# EAGLE design usbprog_v3 (EAGLE 4.16)
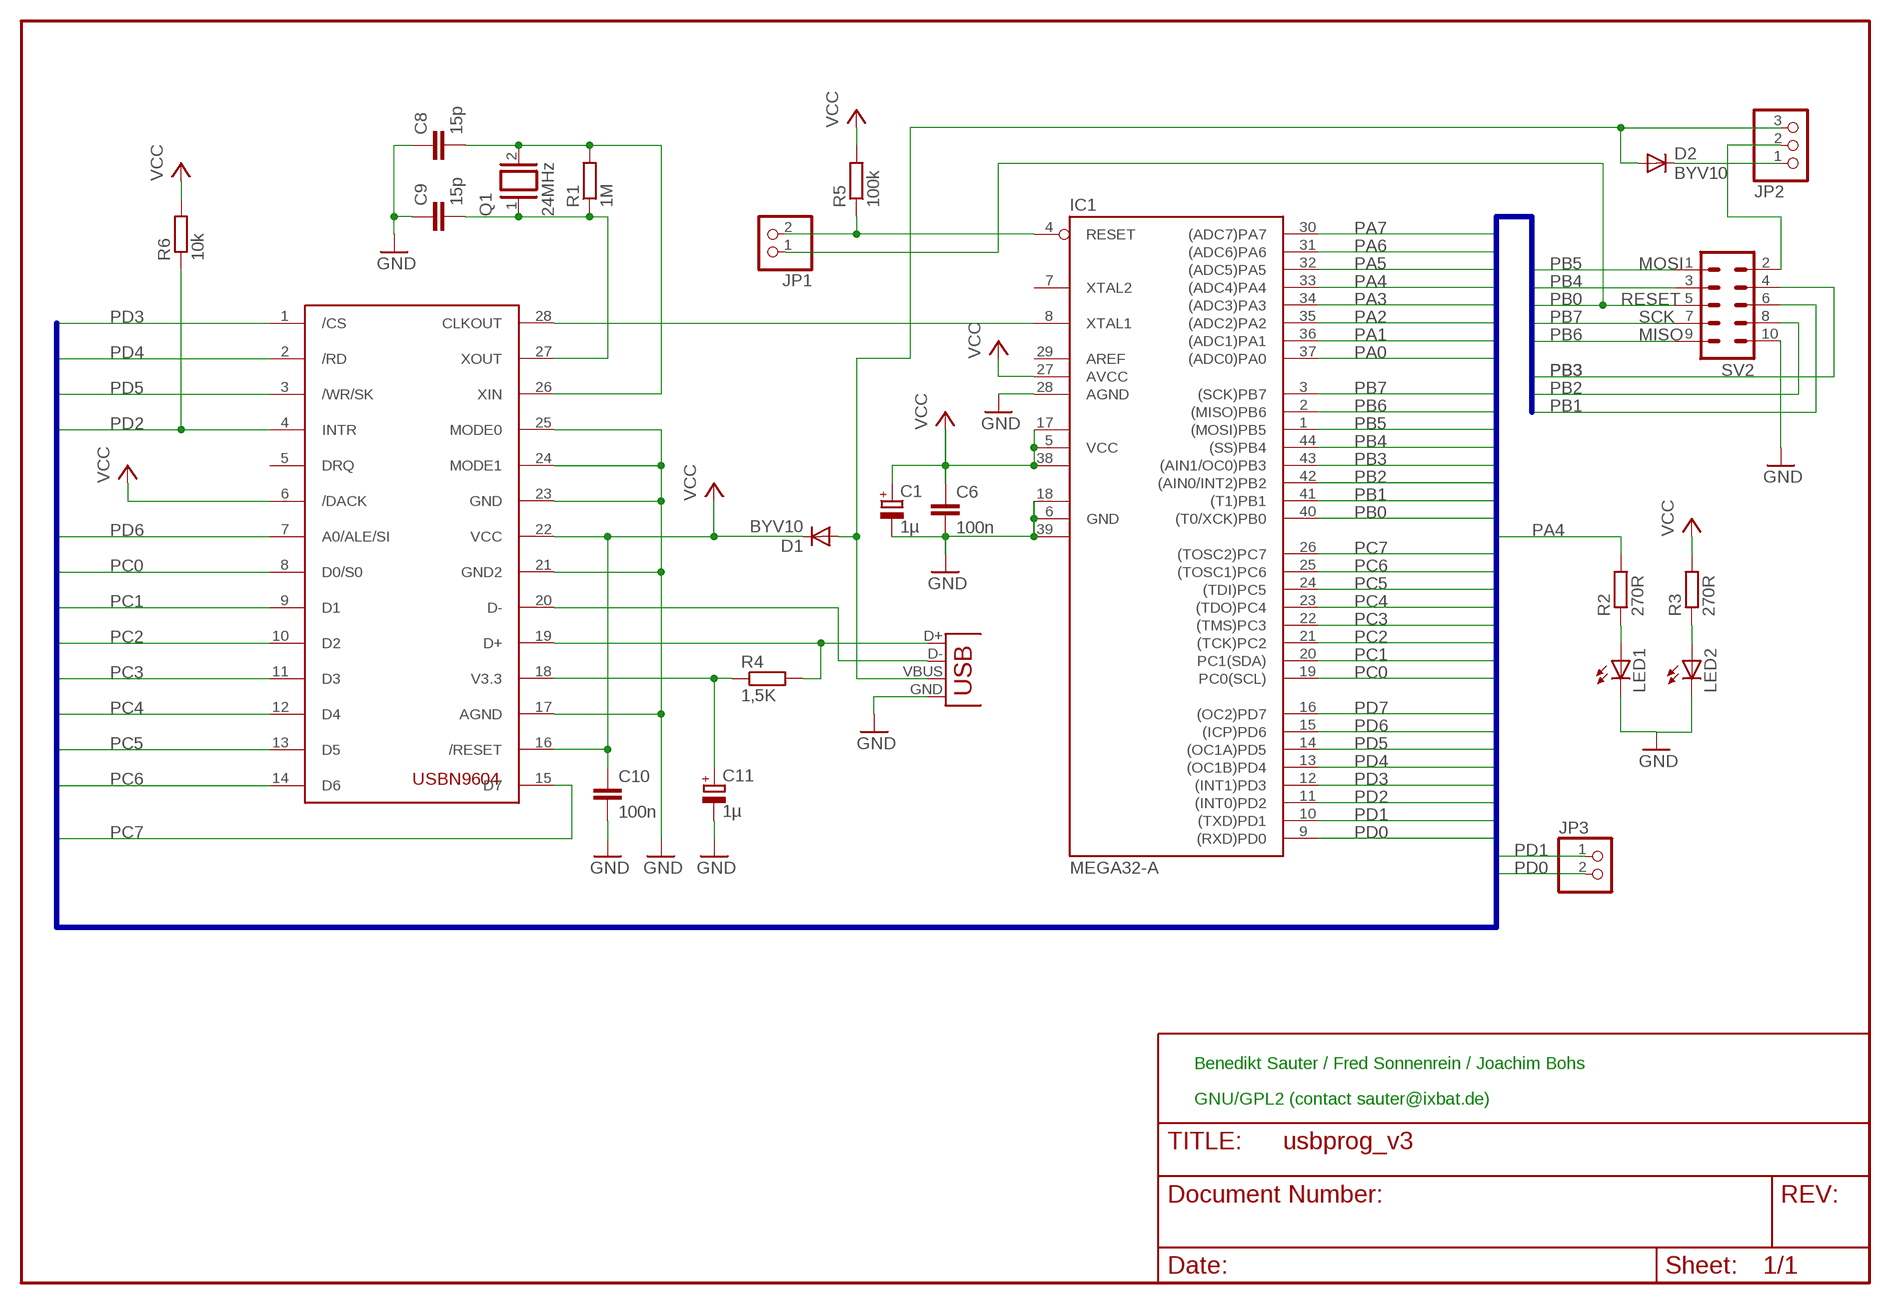
[diagram p0: schematic, sheet 1]

## Parts
C1  1µ  CPOL-EUCT3528  [CT3528]
C6  100n  C-EUC1206  [C1206]
C8  15p  C-EUC1206  [C1206]
C9  15p  C-EUC1206  [C1206]
C10  100n  C-EUC1206  [C1206]
C11  1µ  CPOL-EUCT3528  [CT3528]
D1  BYV10  DIODE-MELF-MLL41  [MELF-MLL41]
D2  BYV10  DIODE-MELF-MLL41  [MELF-MLL41]
IC1  MEGA32-A  [TQFP44]
IC2  USBN9604  [SO28-3]
JP1  PINHD-1X2  [1X02]
JP2  PINHD-1X3  [1X03]
JP3  PINHD-1X2  [1X02]
LED1  LEDCHIP-LED0805  [CHIP-LED0805]
LED2  LEDCHIP-LED0805  [CHIP-LED0805]
Q1  24MHz  XTAL/S  [QS]
R1  1M  R-EU_R1206  [R1206]
R2  270R  R-EU_M1206  [M1206]
R3  270R  R-EU_M1206  [M1206]
R4  1,5K  R-EU_M1206  [M1206]
R5  100k  R-EU_R1206  [R1206]
R6  10k  R-EU_R1206  [R1206]
SV2  ML10L  [ML10L]
X2  USB-B-H  [USB-B-H]

## Nets
GND: C1.- C6.2 C8.1 C9.1 C10.2 C11.- IC1.6(GND) IC1.18(GND1) IC1.28(AGND) IC1.39(GND2) IC2.17(AGND) IC2.21(GND2) IC2.23(GND) IC2.24(MODE1) IC2.25(MODE0) LED1.C LED2.C SV2.10 X2.GND
N$1: D1.A D2.A JP2.3 X2.VBUS
N$2: JP2.2 SV2.2
N$3: D2.C JP2.1
N$4: IC1.8(XTAL1) IC2.28(CLKOUT)
N$7: C11.+ IC2.18(V3.3) R4.1
N$8: C8.2 IC2.26(XIN) Q1.2 R1.2
N$9: LED1.A R2.1
N$10: LED2.A R3.1
N$11: C9.2 IC2.27(XOUT) Q1.1 R1.1
N$12: IC2.19(D+) R4.2 X2.D+
N$15: IC2.20(D-) X2.D-
PA0: IC1.37((ADC0)PA0)
PA1: IC1.36((ADC1)PA1)
PA2: IC1.35((ADC2)PA2)
PA3: IC1.34((ADC3)PA3)
PA4: IC1.33((ADC4)PA4) R2.2
PA5: IC1.32((ADC5)PA5)
PA6: IC1.31((ADC6)PA6)
PA7: IC1.30((ADC7)PA7)
PB0: IC1.40((T0/XCK)PB0) JP1.1 SV2.5
PB1: IC1.41((T1)PB1) SV2.6
PB2: IC1.42((AIN0/INT2)PB2) SV2.8
PB3: IC1.43((AIN1/OC0)PB3) SV2.4
PB4: IC1.44((SS)PB4) SV2.3
PB5: IC1.1((MOSI)PB5) SV2.1
PB6: IC1.2((MISO)PB6) SV2.9
PB7: IC1.3((SCK)PB7) SV2.7
PC0: IC1.19(PC0(SCL)) IC2.8(D0/S0)
PC1: IC1.20(PC1(SDA)) IC2.9(D1)
PC2: IC1.21((TCK)PC2) IC2.10(D2)
PC3: IC1.22((TMS)PC3) IC2.11(D3)
PC4: IC1.23((TDO)PC4) IC2.12(D4)
PC5: IC1.24((TDI)PC5) IC2.13(D5)
PC6: IC1.25((TOSC1)PC6) IC2.14(D6)
PC7: IC1.26((TOSC2)PC7) IC2.15(D7)
PD0: IC1.9((RXD)PD0) JP3.2
PD1: IC1.10((TXD)PD1) JP3.1
PD2: IC1.11((INT0)PD2) IC2.4(INTR) R6.1
PD3: IC1.12((INT1)PD3) IC2.1(/CS)
PD4: IC1.13((OC1B)PD4) IC2.2(/RD)
PD5: IC1.14((OC1A)PD5) IC2.3(/WR/SK)
PD6: IC1.15((ICP)PD6) IC2.7(A0/ALE/SI)
PD7: IC1.16((OC2)PD7)
RESET: IC1.4(RESET) JP1.2 R5.1
VCC: C1.+ C6.1 C10.1 D1.C IC1.5(VCC) IC1.17(VCC1) IC1.27(AVCC) IC1.38(VCC2) IC2.6(/DACK) IC2.16(/RESET) IC2.22(VCC) R3.2 R5.2 R6.2
Unconnected: IC1.7(XTAL2) IC2.5(DRQ)

## Buses
PD0,PD1,PD2,PD3,PD4,PD5,PD6,PD7,PC0,PC1,PC2,PC3,PC4,PC5,PC6,PC7,PB0,PB1,PB2,PB3,PB4,PB5,PB6,PB7,PA0,PA1,PA2,PA3,PA4,PA5,PA6,PA7

## Notes on the sheet
- MOSI
- PB4
- RESET
- SCK
- MISO
- PB3 | PB3
- PB2
- PB1
- Benedikt Sauter / Fred Sonnenrein / Joachim Bohs
- GNU/GPL2 (contact sauter@ixbat.de)

## Power pins joined to a net without a drawn wire
AREF: IC1.29(AREF)

## Library data of the parts
C1 C11 = rcl:CPOL-EU: POLARIZED CAPACITOR, European symbol
C6 C8-C10 = rcl:C-EU: CAPACITOR, European symbol
D1 D2 = diode:DIODE-: DIODE
IC1 = avr:MEGA32: MICROCONTROLLER 32 Kbytes FLASH 2 Kbytes SRAM 1 Kbytes EEPROM USART 8-channel 10 bit ADC
IC2 = bene:USBN9604
JP1 JP3 = pinhead:PINHD-1X2: PIN HEADER
JP2 = pinhead:PINHD-1X3: PIN HEADER
LED1 LED2 = led:LED: LED OSRAM: - CHIPLED LG R971, LG N971, LY N971, LG Q971, LY Q971, LO R971, LY R971 LH N974, LH R974 LS Q976, LO Q976, LY Q976 LO Q996 - Hyper CHIPLED LW Q18S LB Q993, LB Q99A, LB R99A - SideLED LS A670, LO A670, LY A670, LG A670, LP A670 LB A673, LV A673, LT A673, LW A673 LH A674 LY A675 LS A676, LA A676, LO A676, LY A676, LW A676 LS A679, LY A679, LG A679 - Hyper Micro SIDELED® LS Y876, LA Y876, LO Y876, LY Y876 LT Y87S - SmartLED LW L88C, LW L88S LB L89C, LB L89S, LG L890 LS L89K, LO L89K, LY L89K LS L896, LA L896, LO L896, LY L896 - TOPLED LS T670, LO T670, LY T670, LG T670, LP T670 LSG T670, LSP T670, LSY T670, LOP T670, LYG T670 LG T671, LOG T671, LSG T671 LB T673, LV T673, LT T673, LW T673 LH T674 LS T676, LA T676, LO T676, LY T676, LB T676, LH T676, LSB T676, LW T676 LB T67C, LV T67C, LT T67C, LS T67K, LO T67K, LY T67K, LW E67C LS E67B, LA E67B, LO E67B, LY E67B, LB E67C, LV E67C, LT E67C LW T67C LS T679, LY T679, LG T679 LS T770, LO T770, LY T770, LG T770, LP T770 LB T773, LV T773, LT T773, LW T773 LH T774 LS E675, LA E675, LY E675, LS T675 LS T776, LA T776, LO T776, LY T776, LB T776 LHGB T686 LT T68C, LB T68C - Hyper Mini TOPLED® LB M676 - Mini TOPLED Santana® LG M470 LS M47K, LO M47K, LY M47K Source: http://www.osram.convergy.de/
Q1 = special:XTAL/S: CRYSTAL
R1-R6 = rcl:R-EU_: RESISTOR, European symbol
SV2 = con-harting-ml:ML10: HARTING
X2 = con-usb:USB: USB Connectors

## Board
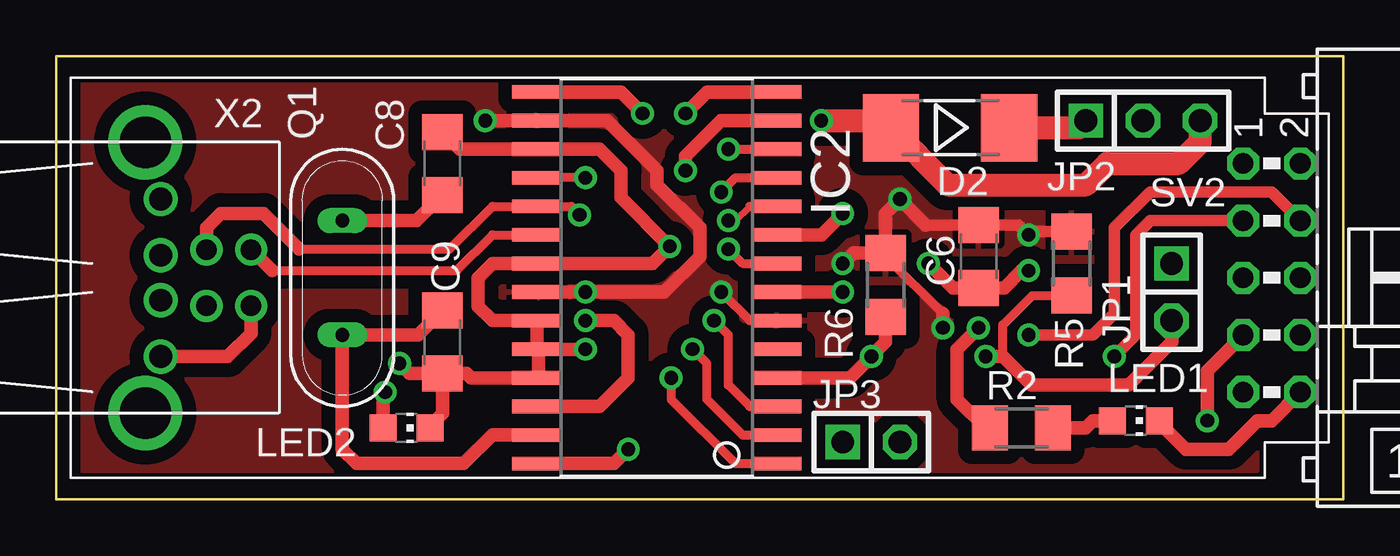
[diagram p1: board, top side]
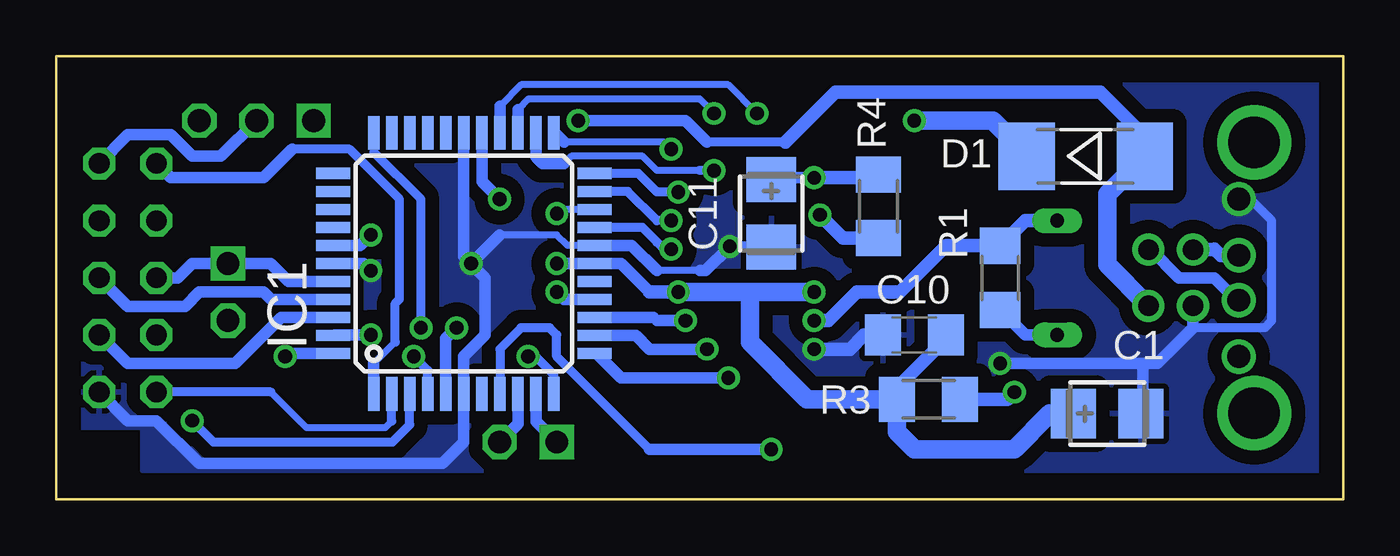
[diagram p2: board, bottom side, seen from below]

Size 57.15 x 19.69 mm. Coordinates in mm from the lower left corner, seen from the top.
Outline: 0,19.69 57.15,19.69 57.15,0 0,0 0,19.69
Copper layers (1*16): Top 0.035mm / dielectric 1.5mm / Bottom 0.035mm
Design rules "Bilex-Lp": minimum track width 10mil, minimum drill 24mil, track to track 10mil, track to pad 10mil, pad to pad 10mil, via to via 10mil, smd to smd 10mil, copper to edge 40mil, drill to drill 8mil, minimum pad ring 10mil, minimum via ring 8mil, stop-mask expansion 4mil, vias tented up to drill 0mil, thermal gap 10mil

### Footprints (pad centres in the part's own frame; a part is rotated, then mirrored left to right if it is on the bottom)
CT3528 = smd 2 x 2.2: + 1.5,0; - -1.5,0
C1206 = smd 1.6 x 1.8: 1 -1.4,0; 2 1.4,0
MELF-MLL41 = smd 2.5 x 3: A 2.625,0; C -2.625,0
TQFP44 = smd 1.5 x 0.5: 1 -5.8,4; 2 -5.8,3.2; 3 -5.8,2.4; 4 -5.8,1.6; 5 -5.8,0.8; 6 -5.8,0; 7 -5.8,-0.8; 8 -5.8,-1.6; 9 -5.8,-2.4; 10 -5.8,-3.2; 11 -5.8,-4; 23 5.8,-4; 24 5.8,-3.2; 25 5.8,-2.4; 26 5.8,-1.6; 27 5.8,-0.8; 28 5.8,0; 29 5.8,0.8; 30 5.8,1.6; 31 5.8,2.4; 32 5.8,3.2; 33 5.8,4 | smd 0.5 x 1.5: 12 -4,-5.8; 13 -3.2,-5.8; 14 -2.4,-5.8; 15 -1.6,-5.8; 16 -0.8,-5.8; 17 0,-5.8; 18 0.8,-5.8; 19 1.6,-5.8; 20 2.4,-5.8; 21 3.2,-5.8; 22 4,-5.8; 34 4,5.8; 35 3.2,5.8; 36 2.4,5.8; 37 1.6,5.8; 38 0.8,5.8; 39 0,5.8; 40 -0.8,5.8; 41 -1.6,5.8; 42 -2.4,5.8; 43 -3.2,5.8; 44 -4,5.8
SO28-3 = smd 0.61 x 2.21: 1 -8.255,-5.315; 2 -6.985,-5.315; 3 -5.715,-5.315; 4 -4.445,-5.315; 5 -3.175,-5.315; 6 -1.905,-5.315; 7 -0.635,-5.315; 8 0.635,-5.315; 9 1.905,-5.315; 10 3.175,-5.315; 11 4.445,-5.315; 12 5.715,-5.315; 13 6.985,-5.315; 14 8.255,-5.315; 15 8.255,5.315; 16 6.985,5.315; 17 5.715,5.315; 18 4.445,5.315; 19 3.175,5.315; 20 1.905,5.315; 21 0.635,5.315; 22 -0.635,5.315; 23 -1.905,5.315; 24 -3.175,5.315; 25 -4.445,5.315; 26 -5.715,5.315; 27 -6.985,5.315; 28 -8.255,5.315
1X02 = drill 1.016 square: 1 -1.27,0 | drill 1.016 octagon: 2 1.27,0
1X03 = drill 1.016 square: 1 -2.54,0 | drill 1.016 octagon: 2 0,0; 3 2.54,0
CHIP-LED0805 = smd 1.2 x 1.2: A 0,-1.05; C 0,1.05
QS = drill 0.61 long: 1 -2.54,0; 2 2.54,0
R1206 = smd 1.6 x 1.803: 1 -1.422,0; 2 1.422,0
M1206 = smd 1.6 x 2: 1 -1.4,0; 2 1.4,0
ML10L = drill 0.914 octagon: 1 -5.08,-1.27; 2 -5.08,1.27; 3 -2.54,-1.27; 4 -2.54,1.27; 5 0,-1.27; 6 0,1.27; 7 2.54,-1.27; 8 2.54,1.27; 9 5.08,-1.27; 10 5.08,1.27
USB-B-H = drill 0.914 round: D+ 0,1.25; D- 1.981,1.25; GND 0,-1.25; VBUS 1.981,-1.25 | drill 2.286 round: P$1 -2.718,-6.02; P$2 -2.718,6.02

### Placement (x,y rotation side)
C1  10.48,3.81 180 bottom
C6  40.96,10.79 270 top
C8  17.15,14.92 270 top
C9  17.15,6.98 90 top
C10  19.05,7.3 180 bottom
C11  25.4,12.7 90 bottom
D1  11.43,15.24 0 bottom
D2  39.69,16.51 180 top
IC1  39.05,10.48 90 bottom
IC2  26.67,9.84 90 top
JP1  49.53,9.21 270 top
JP2  48.26,16.83 0 top
JP3  36.2,2.54 0 top
LED1  47.94,3.49 270 top
LED2  15.56,3.18 270 top
Q1  12.7,9.84 90 top
R1  15.24,9.84 90 bottom
R2  42.86,3.18 180 top
R3  18.42,4.45 180 bottom
R4  20.64,13.02 270 bottom
R5  45.09,10.48 90 top
R6  36.83,9.53 90 top
SV2  53.98,9.84 270 top
X2  6.67,9.84 0 top

### Tracks (layer width: path | path; a pad name or v marks a point on that pad's centre or on a via)
GND  (via drill 0.61 pad 0.81, 1.02 pad 1.02)
  Top 0.305: 48.99,3.39 LED1.C | 16.61,3.27 LED2.C
  Top 0.508: 21.41,6.64 21.4,6.65 | 21.4,6.65 21.4,6.67 | 21.4,6.65 21.36,6.7 | IC2.25 21.36,5.38 21.36,5.37 21.41,5.42
  Top 0.61: v43.18,10.16 42.86,10.16 42.1,9.4 C6.2 39.82,9.4 v38.73,10.48 | SV2.10 53.98,3.49 53.34,3.49 52.07,2.22 50.16,2.22 48.99,3.39 | IC2.25 18.42,5.4 18.23,5.59 C9.1 | v23.5,6.67 21.4,6.67 IC2.24 | C9.1 15.69,5.59 v15.24,6.03 | C8.1 17.91,15.56 IC2.17 24.13,15.56 25.08,14.6 25.08,13.4 v27.24,11.24 26.48,10.48 IC2.21 19.37,10.48 18.73,9.84 18.73,8.57 19.37,7.94 IC2.23 21.36,6.7 | 16.61,3.27 17.15,3.81 C9.1 | 21.41,5.42 21.41,6.64
  Bottom 0.305: IC1.18 34.45,11.28 34.92,11.75 37.46,11.75 | 28.58,10.16 30.48,10.16
  Bottom 0.406: 4.13,13.34 3.17,12.38 3.17,7.94 3.49,7.62 6.67,7.62
  Bottom 0.508: IC1.28 39.05,10.79 v38.73,10.48 | v43.18,10.16 43.5,10.48 IC1.39 | SV2.10 53.98,3.49 52.7,3.49 50.8,1.59 40,1.59 39.05,2.54 IC1.6 39.05,6.35 38.1,7.3 38.1,9.84 v38.73,10.48 | 4.13,13.34 v4.63,13.34 | 37.46,11.75 v38.73,10.48 | IC1.18 31.6,11.28 30.48,10.16 | 8.89,6.03 8.26,6.03 6.67,7.62 X2.GND | 8.89,6.03 v15.24,6.03 | 28.58,10.16 28.32,10.16 v27.24,11.24 27.2,11.2 C11.- | C1.- 8.98,4.04 8.89,4.13 8.89,6.03
  Bottom 0.61: C10.2 21.27,7.3 21.91,6.67 v23.5,6.67
  pour Bottom (isolate 0.61): 0.95,18.41 0.95,1.27 53.34,1.27 53.34,3.18 56.2,3.18 56.2,16.51 53.34,16.51 53.34,18.41
N$1  (via drill 0.61 pad 0.81, 1.02 pad 1.02)
  Top 0.61: v4.63,6.34 7.61,6.34 8.65,7.38 X2.VBUS
  Top 1.016: JP2.3 50.8,15.87 49.85,14.92 46.67,14.92 45.72,13.97 39.6,13.97 D2.A 36.74,16.83 v33.97,16.83
  Bottom 0.406: 24.77,15.87 28.26,15.87
  Bottom 0.508: 28.26,15.87 29.21,16.83 v33.97,16.83
  Bottom 0.61: 24.77,15.87 22.54,18.1 10.79,18.1 8.8,16.11 D1.A
  Bottom 0.813: D1.A 10.48,13.57 10.48,10.42 X2.VBUS
N$2
  Bottom 0.508: SV2.2 53.98,16.19 52.07,16.19 51.12,15.24 49.85,15.24 JP2.2
N$3
  Top 1.016: D2.C 45.4,16.51 JP2.1
N$4  (via drill 0.61 pad 0.81)
  Top 0.61: IC2.28 24.77,1.59 v25.4,2.22
  Bottom 0.406: IC1.8 37.45,6.68 36.51,7.62 35.24,7.62 34.92,7.3 34.92,6.35 30.8,2.22
  Bottom 0.508: v25.4,2.22 30.8,2.22
N$7  (via drill 0.61 pad 0.81)
  Top 0.406: v23.5,14.29 IC2.18
  Bottom 0.305: R4.1 20.77,14.29
  Bottom 0.508: C11.+ 24.85,14.2 24.77,14.29 v23.5,14.29
  Bottom 0.61: 20.77,14.29 v23.5,14.29
N$8  (via drill 0.61 pad 0.81)
  Top 0.61: IC2.26 24.13,4.13 25.4,5.4 25.4,7.3 24.77,7.94 v23.5,7.94 | C8.2 16,12.38 Q1.2
  Bottom 0.61: Q1.2 14.12,12.38 R1.2 17.63,11.26 19.69,9.21 21.59,9.21 22.86,7.94 v23.5,7.94
N$9
  Top 0.61: LED1.A 46.04,3.49 45.72,3.18 R2.1
N$10  (via drill 0.61 pad 0.81)
  Top 0.61: LED2.A 14.51,4.66 v14.61,4.76
  Bottom 0.61: R3.1 14.92,4.45 v14.61,4.76
N$11
  Top 0.61: C9.2 16.06,7.3 Q1.1 12.7,2.22 13.33,1.59 18.1,1.59 19.37,2.86 IC2.27
  Bottom 0.508: R1.1 14.12,7.3 Q1.1
N$12  (via drill 0.61 pad 0.81, 1.02 pad 1.02)
  Top 0.406: 10.79,11.11 17.46,11.11 19.37,13.02 IC2.19 22.86,13.02 v23.24,12.64
  Top 0.61: X2.D+ 6.67,12.07 7.3,12.7 9.21,12.7 10.79,11.11
  Bottom 0.305: 5.71,11.11 5.73,11.09
  Bottom 0.61: v4.63,10.84 5.44,10.84 5.71,11.11 | 5.73,11.09 X2.D+ | R4.2 22.22,11.62 v23.24,12.64
N$15  (via drill 1.02 pad 1.02)
  Top 0.406: 9.58,10.16 17.78,10.16 19.37,11.75 IC2.20
  Top 0.61: X2.D- 9.58,10.16
  Bottom 0.305: 8.55,11.09 X2.D- | v4.63,8.84 4.71,8.84
  Bottom 0.508: 8.55,11.09 7.3,9.84 5.71,9.84 4.71,8.84
PA4  (via drill 0.61 pad 0.81)
  Top 0.305: R2.2 41.27,3.18
  Top 0.61: v40.96,7.62 40,6.67 40,4.45 41.27,3.18
  Bottom 0.305: 43.05,15.43 IC1.33
  Bottom 0.406: 43.05,15.43 40.96,13.34 v40.96,7.62
PB0
  Bottom 0.508: IC1.40 46.82,9.68 47.62,10.48 JP1.1 51.12,10.48 51.75,9.84 SV2.5
PB1
  Bottom 0.508: SV2.6 53.98,8.57 51.43,8.57 50.8,9.21 47.94,9.21 47.61,8.88 IC1.41
PB2
  Bottom 0.508: SV2.8 53.98,6.03 49.21,6.03 47.17,8.08 IC1.42
PB3  (via drill 0.61 pad 0.81)
  Top 0.508: SV2.4 53.98,13.65 48.58,13.65 46.99,12.07 46.99,8.26 46.04,7.3 v43.18,7.3
  Bottom 0.305: 44.77,7.3 44.79,7.28 IC1.43
  Bottom 0.508: v43.18,7.3 44.77,7.3
PB4  (via drill 0.61 pad 0.81)
  Top 0.508: v46.99,6.35 47.94,7.3 47.94,11.75 48.58,12.38 SV2.3
  Bottom 0.508: IC1.44 46.86,6.48 v46.99,6.35
PB5
  Bottom 0.305: 43.05,6.03 42.1,6.98
  Bottom 0.406: 46.67,15.56 44.13,15.56 41.91,13.34 41.91,8.89 42.1,8.7 42.1,6.98
  Bottom 0.508: 46.67,15.56 47.94,14.29 52.07,14.29 SV2.1 | IC1.1 43.05,6.03
PB6
  Bottom 0.305: 47.62,4.76 46.04,3.18 42.54,3.18 42.25,3.47
  Bottom 0.406: 47.62,4.76 SV2.9 | 42.25,3.47 IC1.2
PB7  (via drill 0.61 pad 0.81)
  Top 0.61: v51.12,3.49 51.12,5.72 SV2.7
  Bottom 0.406: IC1.3 41.45,3.31 42.23,2.54 50.16,2.54 v51.12,3.49
PC0  (via drill 0.61 pad 0.81)
  Top 0.406: v29.85,11.11 30.48,10.48 IC2.8
  Bottom 0.406: IC1.19 31.13,12.08 30.48,11.43 30.16,11.11 v29.85,11.11
PC1  (via drill 0.61 pad 0.81)
  Top 0.61: IC2.9 33.97,11.75 v34.92,12.7
  Bottom 0.305: IC1.20 34.75,12.88 v34.92,12.7
PC2  (via drill 0.61 pad 0.81)
  Top 0.305: 30.16,12.38 30.8,13.02
  Top 0.406: 30.8,13.02 IC2.10 | v29.85,12.38 30.16,12.38
  Bottom 0.406: IC1.21 31.78,13.68 30.48,12.38 v29.85,12.38
PC3  (via drill 0.61 pad 0.81)
  Top 0.406: IC2.11 30.16,14.29 v29.53,13.65
  Bottom 0.406: IC1.22 31.31,14.48 30.48,13.65 v29.53,13.65
PC4  (via drill 0.61 pad 0.81)
  Top 0.406: v29.85,15.56 IC2.12
  Bottom 0.305: 35.01,16.28 IC1.23 | 34.61,15.87 30.16,15.87 v29.85,15.56
  Bottom 0.508: 34.61,15.87 35.01,16.28
PC5  (via drill 0.61 pad 0.81)
  Top 0.61: v27.94,14.6 27.94,15.24 29.53,16.83 IC2.13
  Bottom 0.305: 34.61,14.92 34.29,15.24 31.12,15.24 30.48,14.6 28.58,14.6
  Bottom 0.406: v27.94,14.6 28.58,14.6
  Bottom 0.508: IC1.24 35.85,15.21 35.56,14.92 34.61,14.92
PC6  (via drill 0.61 pad 0.81)
  Top 0.406: IC2.14 32.07,18.1
  Top 0.61: v27.94,17.14 28.89,18.1 IC2.14
  Bottom 0.305: 36.65,17.32 36.2,17.78 28.58,17.78 v27.94,17.14
  Bottom 0.508: 36.65,17.32 IC1.25
PC7  (via drill 0.61 pad 0.81)
  Top 0.61: v26.04,17.14 25.08,18.1 IC2.15
  Bottom 0.305: 37.45,17.48 36.51,18.41 27.31,18.41 v26.04,17.14
  Bottom 0.508: 37.45,17.48 IC1.26
PD0
  Bottom 0.508: IC1.9 36.65,3.35 JP3.2
PD1
  Bottom 0.508: IC1.10 35.85,3.47 JP3.1
PD2  (via drill 0.61 pad 0.81)
  Top 0.61: R6.1 36.83,6.98 v36.2,6.35 35.24,5.4 IC2.4
  Bottom 0.305: 35.05,5.52 IC1.11
  Bottom 0.406: 35.05,5.52 35.88,6.35 v36.2,6.35
PD3  (via drill 0.61 pad 0.81)
  Top 0.406: IC2.1 30.16,1.59 27.31,4.45 v27.31,5.4
  Bottom 0.508: v27.31,5.4 32.07,5.4 33.15,6.48 IC1.12
PD4  (via drill 0.61 pad 0.81)
  Top 0.406: IC2.2 30.48,2.86 28.89,4.45 28.89,6.03 v28.26,6.67
  Bottom 0.508: v28.26,6.67 30.8,6.67 31.41,7.28 IC1.13
PD5  (via drill 0.61 pad 0.81)
  Top 0.406: IC2.3 30.8,4.13 29.85,5.08 29.85,7.3 v29.21,7.94
  Bottom 0.508: v29.21,7.94 30.48,7.94 30.62,8.08 IC1.14
PD6  (via drill 0.61 pad 0.81)
  Top 0.61: v34.92,9.21 IC2.7
  Bottom 0.508: IC1.15 34.59,8.88 v34.92,9.21
RESET  (via drill 0.61 pad 0.81)
  Top 0.406: R5.1 43.35,9.06 42.04,7.75 42.04,6.35
  Top 0.61: JP1.2 49.53,6.98 47.62,5.08 43.31,5.08 42.04,6.35 v41.27,6.35
  Bottom 0.406: IC1.4 40.65,5.73 v41.27,6.35
VCC  (via drill 0.61 pad 0.81)
  Top 0.305: v43.18,11.75 43.33,11.9
  Top 0.406: v29.53,9.21 30.8,7.94 IC2.6 | R6.2 36.83,10.79 39.37,8.26
  Top 0.508: v43.18,11.75 42.73,12.19 C6.1 38.6,12.19 | 43.33,11.9 R5.2
  Top 0.61: 38.6,12.19 v37.46,13.34 36.83,12.7 R6.2 35.39,10.95 v34.92,10.48 | v19.05,16.83 IC2.16 24.45,16.83 26.67,14.6 26.67,13.97 28.58,12.07 28.58,10.79 26.99,9.21 v23.5,9.21 IC2.22 | 39.37,8.26 v39.37,7.62
  Bottom 0.305: 13.97,15.24 D1.C
  Bottom 0.508: IC1.38 43.65,11.28 v43.18,11.75 | 30.8,9.21 32.07,10.48 IC1.17 v34.92,10.48 | IC1.5 39.85,7.14 v39.37,7.62 | IC1.27 38.25,14.12 v37.46,13.34
  Bottom 0.61: v29.53,9.21 30.8,9.21 | C10.1 17.65,7.11 19.82,4.95 R3.2
  Bottom 0.813: v19.05,16.83 15.56,16.83 13.97,15.24 | 26.35,9.21 26.35,6.98 23.81,4.45 R3.2 19.82,2.99 19.05,2.22 14.61,2.22 13.02,3.81 C1.+ | 26.35,9.21 v23.5,9.21 | 26.35,9.21 v29.53,9.21
  pour Top (isolate 0.61): 0.95,1.27 53.34,1.27 53.34,3.18 56.2,3.18 56.2,16.51 53.34,16.51 53.34,18.41 0.95,18.41

### Text on the board
tDocu: GNU/GPL2 | usbprog 3.0 | www.ixbat.de